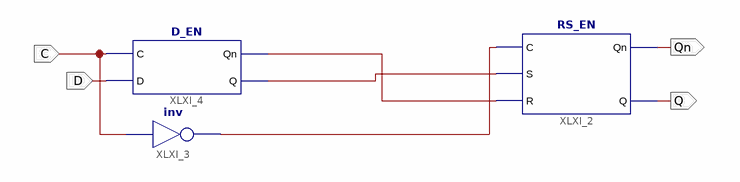
[diagram p0: schematic sheet 1]
// Xilinx ISE schematic D_Trig.sch (kintex7) as structural Verilog: 3 symbols, 4 ports
module D_Trig (
  input  C,
  input  D,
  output Qn,
  output Q
);

  wire XLXN_3, XLXN_4, XLXN_5;

  RS_EN XLXI_2 (.C(XLXN_5), .S(XLXN_4), .R(XLXN_3), .Qn(Qn), .Q(Q));
  not XLXI_3 (XLXN_5, C);
  D_EN XLXI_4 (.C(C), .D(D), .Qn(XLXN_3), .Q(XLXN_4));
endmodule
